# EAGLE schematic sensors (EAGLE 9.4.2)
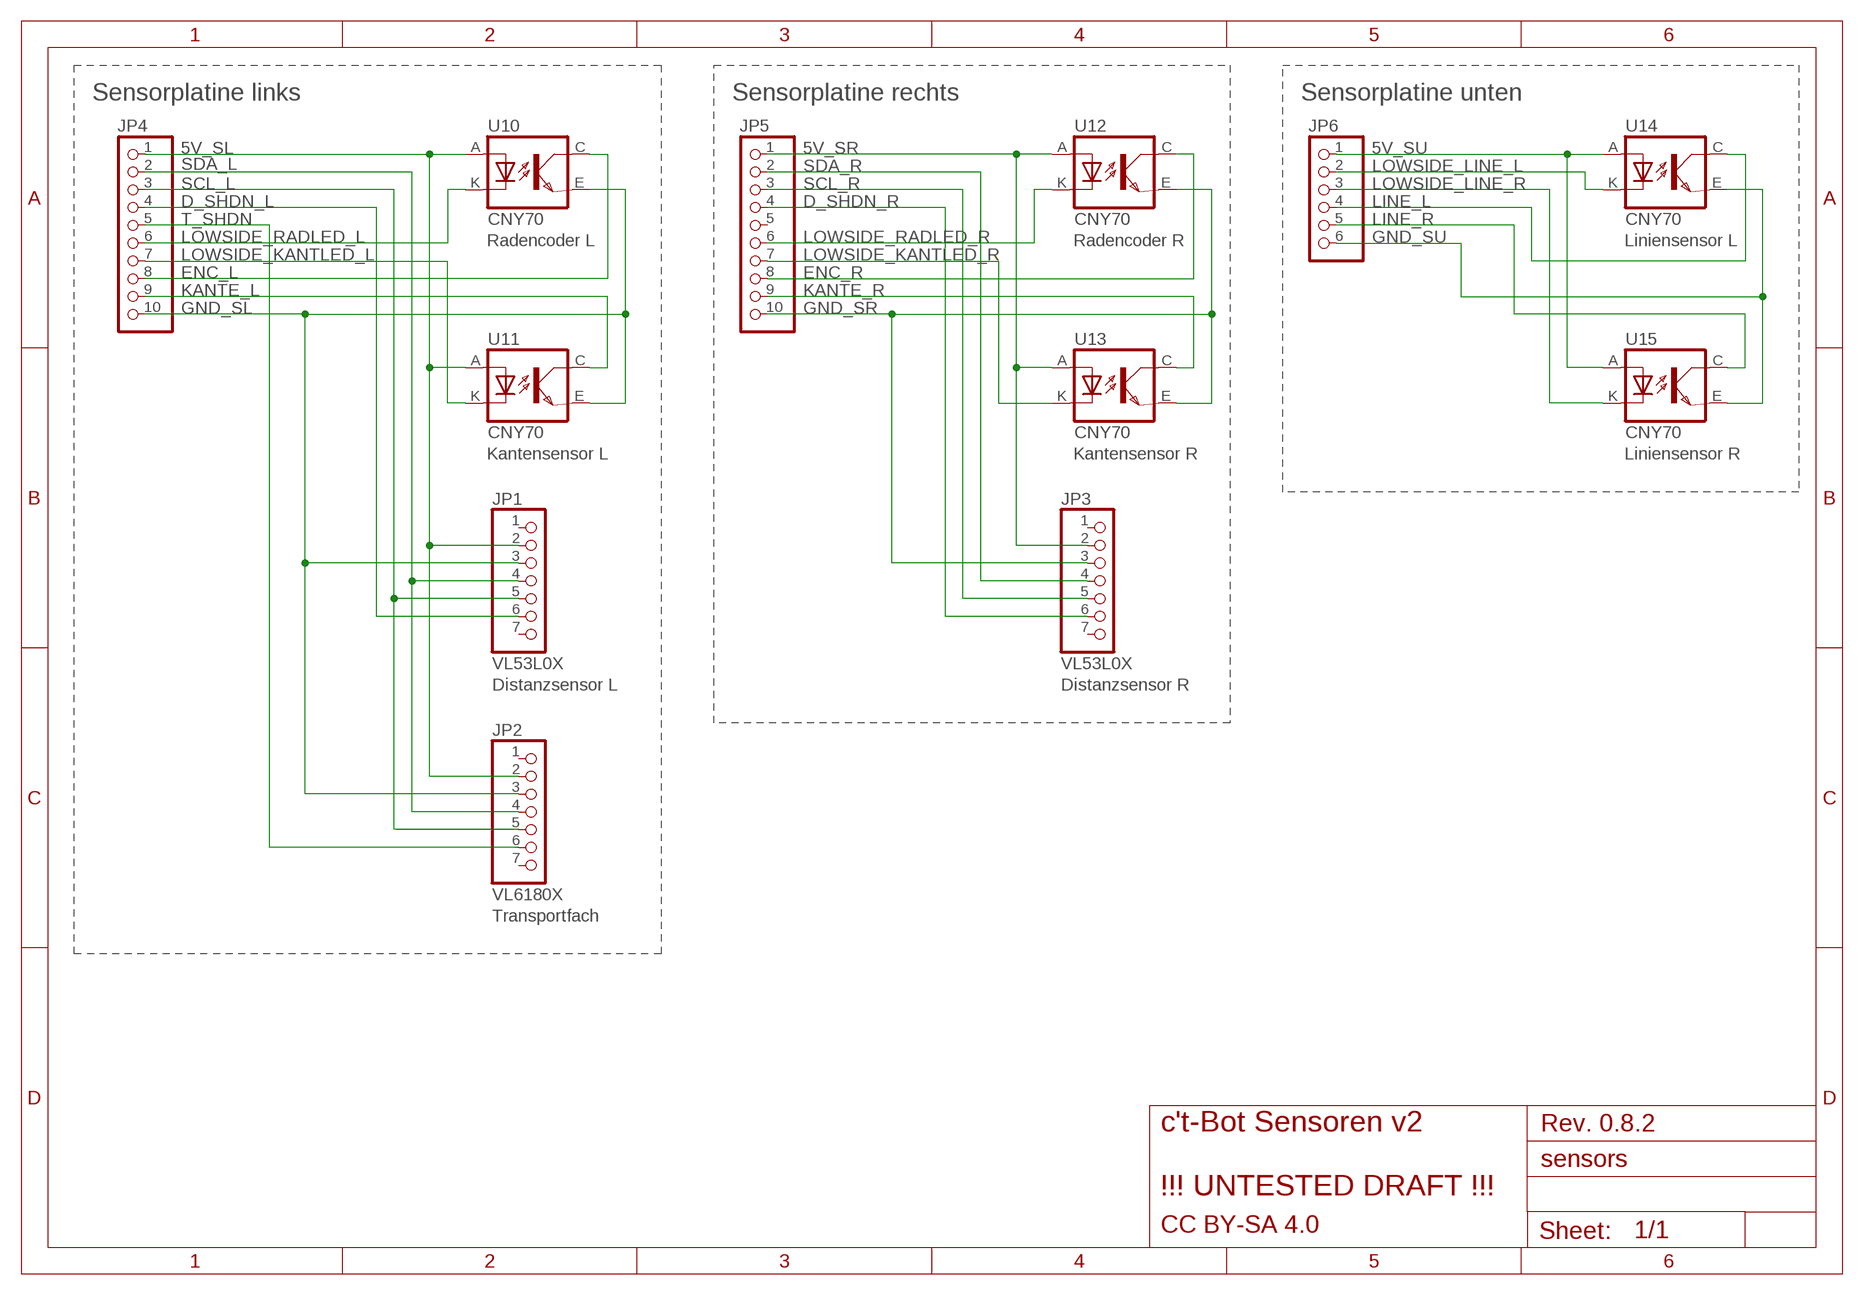
[diagram p0: schematic, sheet 1]

## Parts
JP1  VL53L0X  PINHD-1X7  [1X07]
JP2  VL6180X  PINHD-1X7  [1X07]
JP3  VL53L0X  PINHD-1X7  [1X07]
JP4  PINHD-1X10  [1X10]
JP5  PINHD-1X10  [1X10]
JP6  PINHD-1X6  [1X06]
U10  CNY70  [4]
U11  CNY70  [4]
U12  CNY70  [4]
U13  CNY70  [4]
U14  CNY70  [4]
U15  CNY70  [4]

## Nets
5V_SL: JP1.2 JP2.2 JP4.1 U10.A U11.A
5V_SR: JP3.2 JP5.1 U12.A U13.A
5V_SU: JP6.1 U14.A U15.A
D_SHDN_L: JP1.6 JP4.4
D_SHDN_R: JP3.6 JP5.4
ENC_L: JP4.8 U10.C(COL)
ENC_R: JP5.8 U12.C(COL)
GND_SL: JP1.3 JP2.3 JP4.10 U10.E(EMI) U11.E(EMI)
GND_SR: JP3.3 JP5.10 U12.E(EMI) U13.E(EMI)
GND_SU: JP6.6 U14.E(EMI) U15.E(EMI)
KANTE_L: JP4.9 U11.C(COL)
KANTE_R: JP5.9 U13.C(COL)
LINE_L: JP6.4 U14.C(COL)
LINE_R: JP6.5 U15.C(COL)
LOWSIDE_KANTLED_L: JP4.7 U11.K(C)
LOWSIDE_KANTLED_R: JP5.7 U13.K(C)
LOWSIDE_LINE_L: JP6.2 U14.K(C)
LOWSIDE_LINE_R: JP6.3 U15.K(C)
LOWSIDE_RADLED_L: JP4.6 U10.K(C)
LOWSIDE_RADLED_R: JP5.6 U12.K(C)
SCL_L: JP1.5 JP2.5 JP4.3
SCL_R: JP3.5 JP5.3
SDA_L: JP1.4 JP2.4 JP4.2
SDA_R: JP3.4 JP5.2
T_SHDN: JP2.6 JP4.5
Unconnected: JP1.1 JP1.7 JP2.1 JP2.7 JP3.1 JP3.7 JP5.5

## Notes on the sheet
- Sensorplatine links | Sensorplatine rechts | Sensorplatine unten
- Radencoder L | Radencoder R | Liniensensor L
- Kantensensor L | Kantensensor R | Liniensensor R
- Distanzsensor L | Distanzsensor R
- Transportfach
- Rev. 0.8.2
- c't-Bot Sensoren v2
  
  !!! UNTESTED DRAFT !!!
- CC BY-SA 4.0

## Library data of the parts
JP1-JP3 = ct-bot:PINHD-1X7: PIN HEADER
JP4 JP5 = ct-bot:PINHD-1X10: PIN HEADER
JP6 = ct-bot:PINHD-1X6: PIN HEADER
U10-U15 = ct-bot:CNY70